# Altium schematic sheet TPaletteWindow.schDOC
size B; Organization: Altium Limited; Address1: L3, 12a Rodborough Rd; Address2: Frenchs Forest; Address3: NSW; Address4: Australia 2086; DocumentNumber: 1; SheetNumber: 1; SheetTotal: 3
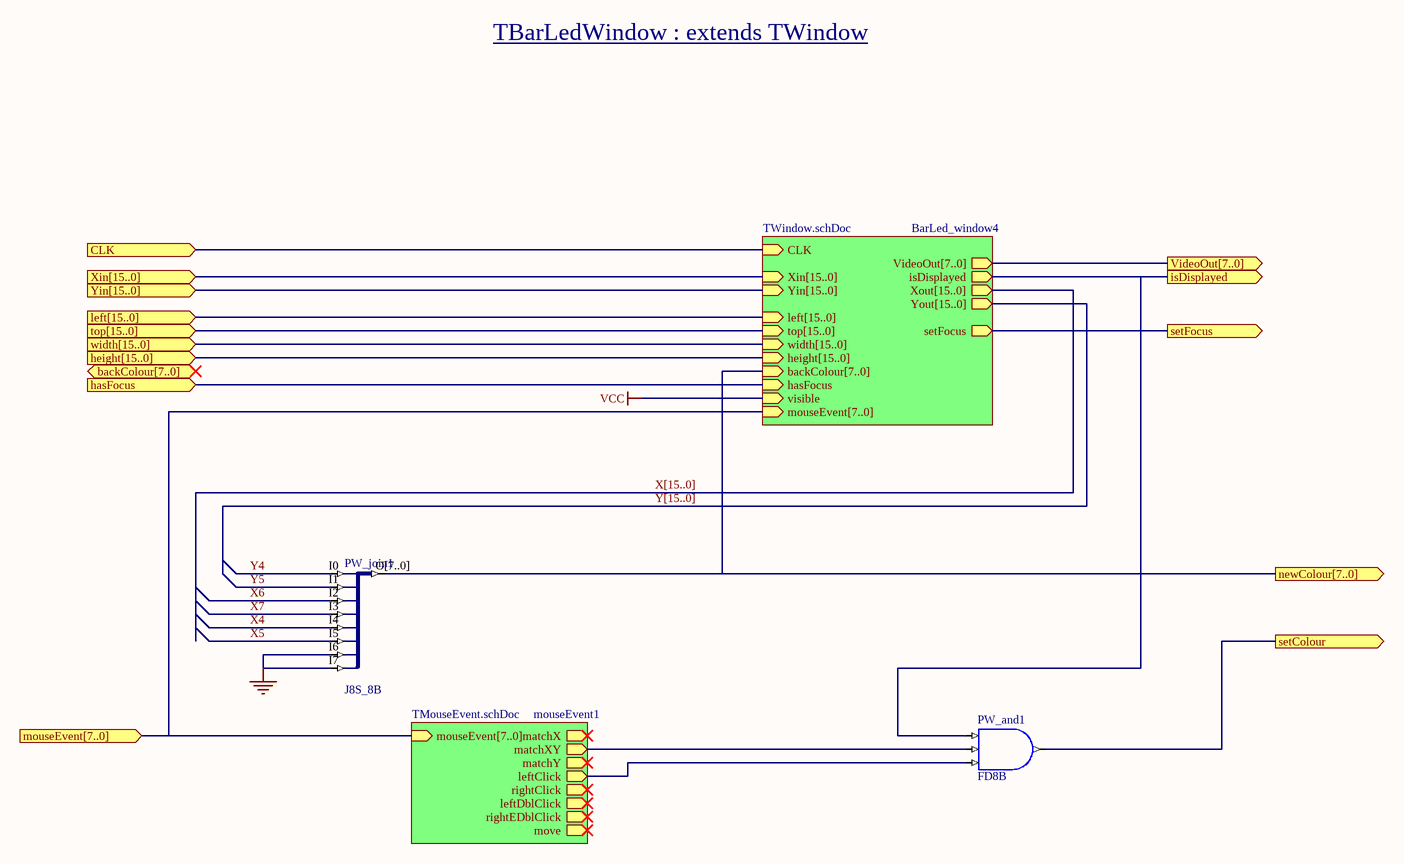
[diagram p0: TPaletteWindow.schDOC]

## Parts
PW_and1  FD8B
PW_join1  J8S_8B

## Sub-sheets
BarLed_window4 = TWindow.schDoc: CLK (in), VideoOut[7..0] (out), Xin[15..0] (in), Yin[15..0] (in), top[15..0] (in), width[15..0] (in), height[15..0] (in), left[15..0] (in), Xout[15..0] (out), Yout[15..0] (out), backColour[7..0] (in), isDisplayed (out), visible (in), hasFocus (in), mouseEvent[7..0] (in), setFocus (out)
mouseEvent1 = TMouseEvent.schDoc: mouseEvent[7..0] (in), matchX (out), matchXY (out), matchY (out), leftClick (out), rightClick (out), leftDblClick (out), rightEDblClick (out), move (out)

## Ports
backColour[7..0] (in), CLK (in), hasFocus (in), height[15..0] (in), isDisplayed (out), left[15..0] (in), mouseEvent[7..0] (in), newColour[7..0] (out), setColour (out), setFocus (out), top[15..0] (in), VideoOut[7..0] (out), width[15..0] (in), Xin[15..0] (in), Yin[15..0] (in)

## Nets
GND: PW_join1.I6 PW_join1.I7
VCC: sheet BarLed_window4/visible
CLK: port CLK, sheet BarLed_window4/CLK
hasFocus: port hasFocus, sheet BarLed_window4/hasFocus
isDisplayed: PW_and1.I0 ; port isDisplayed, sheet BarLed_window4/isDisplayed
newColour[7..0]: PW_join1.O[7..0] ; port newColour[7..0], sheet BarLed_window4/backColour[7..0]
setColour: PW_and1.O ; port setColour
setFocus: port setFocus, sheet BarLed_window4/setFocus
X4: PW_join1.I4
X5: PW_join1.I5
X6: PW_join1.I2
X7: PW_join1.I3
Y4: PW_join1.I0
Y5: PW_join1.I1
NetPW_and1_I1: PW_and1.I1 ; sheet mouseEvent1/matchXY
NetPW_and1_I2: PW_and1.I2 ; sheet mouseEvent1/leftClick

## Buses and harness runs
bus port height[15..0] = sheet BarLed_window4/height[15..0]
bus port left[15..0] = sheet BarLed_window4/left[15..0]
bus port mouseEvent[7..0] = sheet BarLed_window4/mouseEvent[7..0] = sheet mouseEvent1/mouseEvent[7..0]
bus port newColour[7..0] = sheet BarLed_window4/backColour[7..0]
bus port top[15..0] = sheet BarLed_window4/top[15..0]
bus port VideoOut[7..0] = sheet BarLed_window4/VideoOut[7..0]
bus port width[15..0] = sheet BarLed_window4/width[15..0]
bus port Xin[15..0] = sheet BarLed_window4/Xin[15..0]
bus port Yin[15..0] = sheet BarLed_window4/Yin[15..0]
bus X[15..0] = sheet BarLed_window4/Xout[15..0]
bus Y[15..0] = sheet BarLed_window4/Yout[15..0]

## Notes on the sheet
- TBarLedWindow : extends TWindow
- Title
- Size:
- Date:
- B
- Number:
- Time:
- Revision:
- Sheet
- of
- File:

## Library data of the parts
PW_and1 = AND3S: 3-Input AND Gate, Single Pin Version; Xilinx Equivalent: AND3; ArchiveName: GENERIC; VHDLIB_SIM: GENERIC_LIB; Published: 28-Jan-2004; Publisher: Altium Limited; Core Revision: 1.00.00
PW_join1 = J8S_8B: 8 Single pin inputs to single 8-Bit output bus; ArchiveName: GENERIC; VHDLIB_SIM: GENERIC_LIB; Published: 28-Jan-2004; Publisher: Altium Limited; Core Revision: 1.00.00